# Altium schematic sheet sch_Top.SchDoc
size A4
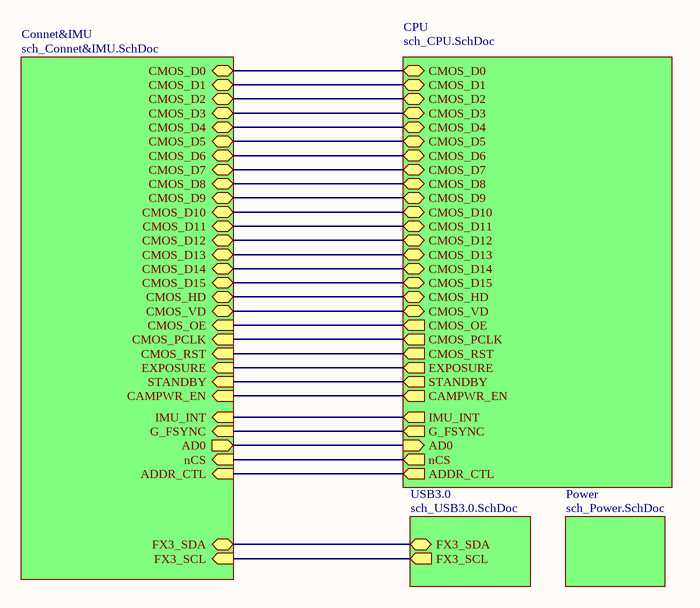
[diagram p0: sch_Top.SchDoc]

## Sub-sheets
Connet&IMU = sch_Connet&IMU.SchDoc: FX3_SCL (in), AD0 (out), nCS (in), STANDBY (in), EXPOSURE (in), CMOS_OE (in), CAMPWR_EN (in), ADDR_CTL (in), CMOS_RST (in), FX3_SDA (bidir), CMOS_HD (bidir), CMOS_PCLK (in), CMOS_VD (bidir), CMOS_D0 (bidir), CMOS_D1 (bidir), CMOS_D2 (bidir), CMOS_D3 (bidir), CMOS_D4 (bidir), CMOS_D5 (bidir), CMOS_D6 (bidir), CMOS_D7 (bidir), CMOS_D8 (bidir), CMOS_D9 (bidir), CMOS_D10 (bidir), CMOS_D11 (bidir), CMOS_D12 (bidir), CMOS_D13 (bidir), CMOS_D14 (bidir), CMOS_D15 (bidir), IMU_INT (in), G_FSYNC (in)
CPU = sch_CPU.SchDoc: AD0 (in), ADDR_CTL (out), CAMPWR_EN (out), CMOS_D0 (bidir), CMOS_D1 (bidir), CMOS_D2 (bidir), CMOS_D3 (bidir), CMOS_D4 (bidir), CMOS_D5 (bidir), CMOS_D6 (bidir), CMOS_D7 (bidir), CMOS_D8 (bidir), CMOS_D9 (bidir), CMOS_D10 (bidir), CMOS_D11 (bidir), CMOS_D12 (bidir), CMOS_D13 (bidir), CMOS_D14 (bidir), CMOS_D15 (bidir), CMOS_HD (bidir), CMOS_VD (bidir), CMOS_OE (out), CMOS_PCLK (out), CMOS_RST (out), EXPOSURE (out), IMU_INT (out), G_FSYNC (out), STANDBY (out), nCS (out)
Power = sch_Power.SchDoc: no entries
USB3.0 = sch_USB3.0.SchDoc: FX3_SDA (bidir), FX3_SCL (out)

## Nets
(unnamed): sheet Connet&IMU/FX3_SCL, sheet USB3.0/FX3_SCL
(unnamed): sheet Connet&IMU/AD0, sheet CPU/AD0
(unnamed): sheet Connet&IMU/nCS, sheet CPU/nCS
(unnamed): sheet Connet&IMU/STANDBY, sheet CPU/STANDBY
(unnamed): sheet Connet&IMU/EXPOSURE, sheet CPU/EXPOSURE
(unnamed): sheet Connet&IMU/CMOS_OE, sheet CPU/CMOS_OE
(unnamed): sheet Connet&IMU/CAMPWR_EN, sheet CPU/CAMPWR_EN
(unnamed): sheet Connet&IMU/ADDR_CTL, sheet CPU/ADDR_CTL
(unnamed): sheet Connet&IMU/CMOS_RST, sheet CPU/CMOS_RST
(unnamed): sheet Connet&IMU/FX3_SDA, sheet USB3.0/FX3_SDA
(unnamed): sheet Connet&IMU/CMOS_HD, sheet CPU/CMOS_HD
(unnamed): sheet Connet&IMU/CMOS_PCLK, sheet CPU/CMOS_PCLK
(unnamed): sheet Connet&IMU/CMOS_VD, sheet CPU/CMOS_VD
(unnamed): sheet Connet&IMU/CMOS_D0, sheet CPU/CMOS_D0
(unnamed): sheet Connet&IMU/CMOS_D1, sheet CPU/CMOS_D1
(unnamed): sheet Connet&IMU/CMOS_D2, sheet CPU/CMOS_D2
(unnamed): sheet Connet&IMU/CMOS_D3, sheet CPU/CMOS_D3
(unnamed): sheet Connet&IMU/CMOS_D4, sheet CPU/CMOS_D4
(unnamed): sheet Connet&IMU/CMOS_D5, sheet CPU/CMOS_D5
(unnamed): sheet Connet&IMU/CMOS_D6, sheet CPU/CMOS_D6
(unnamed): sheet Connet&IMU/CMOS_D7, sheet CPU/CMOS_D7
(unnamed): sheet Connet&IMU/CMOS_D8, sheet CPU/CMOS_D8
(unnamed): sheet Connet&IMU/CMOS_D9, sheet CPU/CMOS_D9
(unnamed): sheet Connet&IMU/CMOS_D10, sheet CPU/CMOS_D10
(unnamed): sheet Connet&IMU/CMOS_D11, sheet CPU/CMOS_D11
(unnamed): sheet Connet&IMU/CMOS_D12, sheet CPU/CMOS_D12
(unnamed): sheet Connet&IMU/CMOS_D13, sheet CPU/CMOS_D13
(unnamed): sheet Connet&IMU/CMOS_D14, sheet CPU/CMOS_D14
(unnamed): sheet Connet&IMU/CMOS_D15, sheet CPU/CMOS_D15
(unnamed): sheet Connet&IMU/IMU_INT, sheet CPU/IMU_INT
(unnamed): sheet Connet&IMU/G_FSYNC, sheet CPU/G_FSYNC